# EAGLE design control (EAGLE 6.6.0)
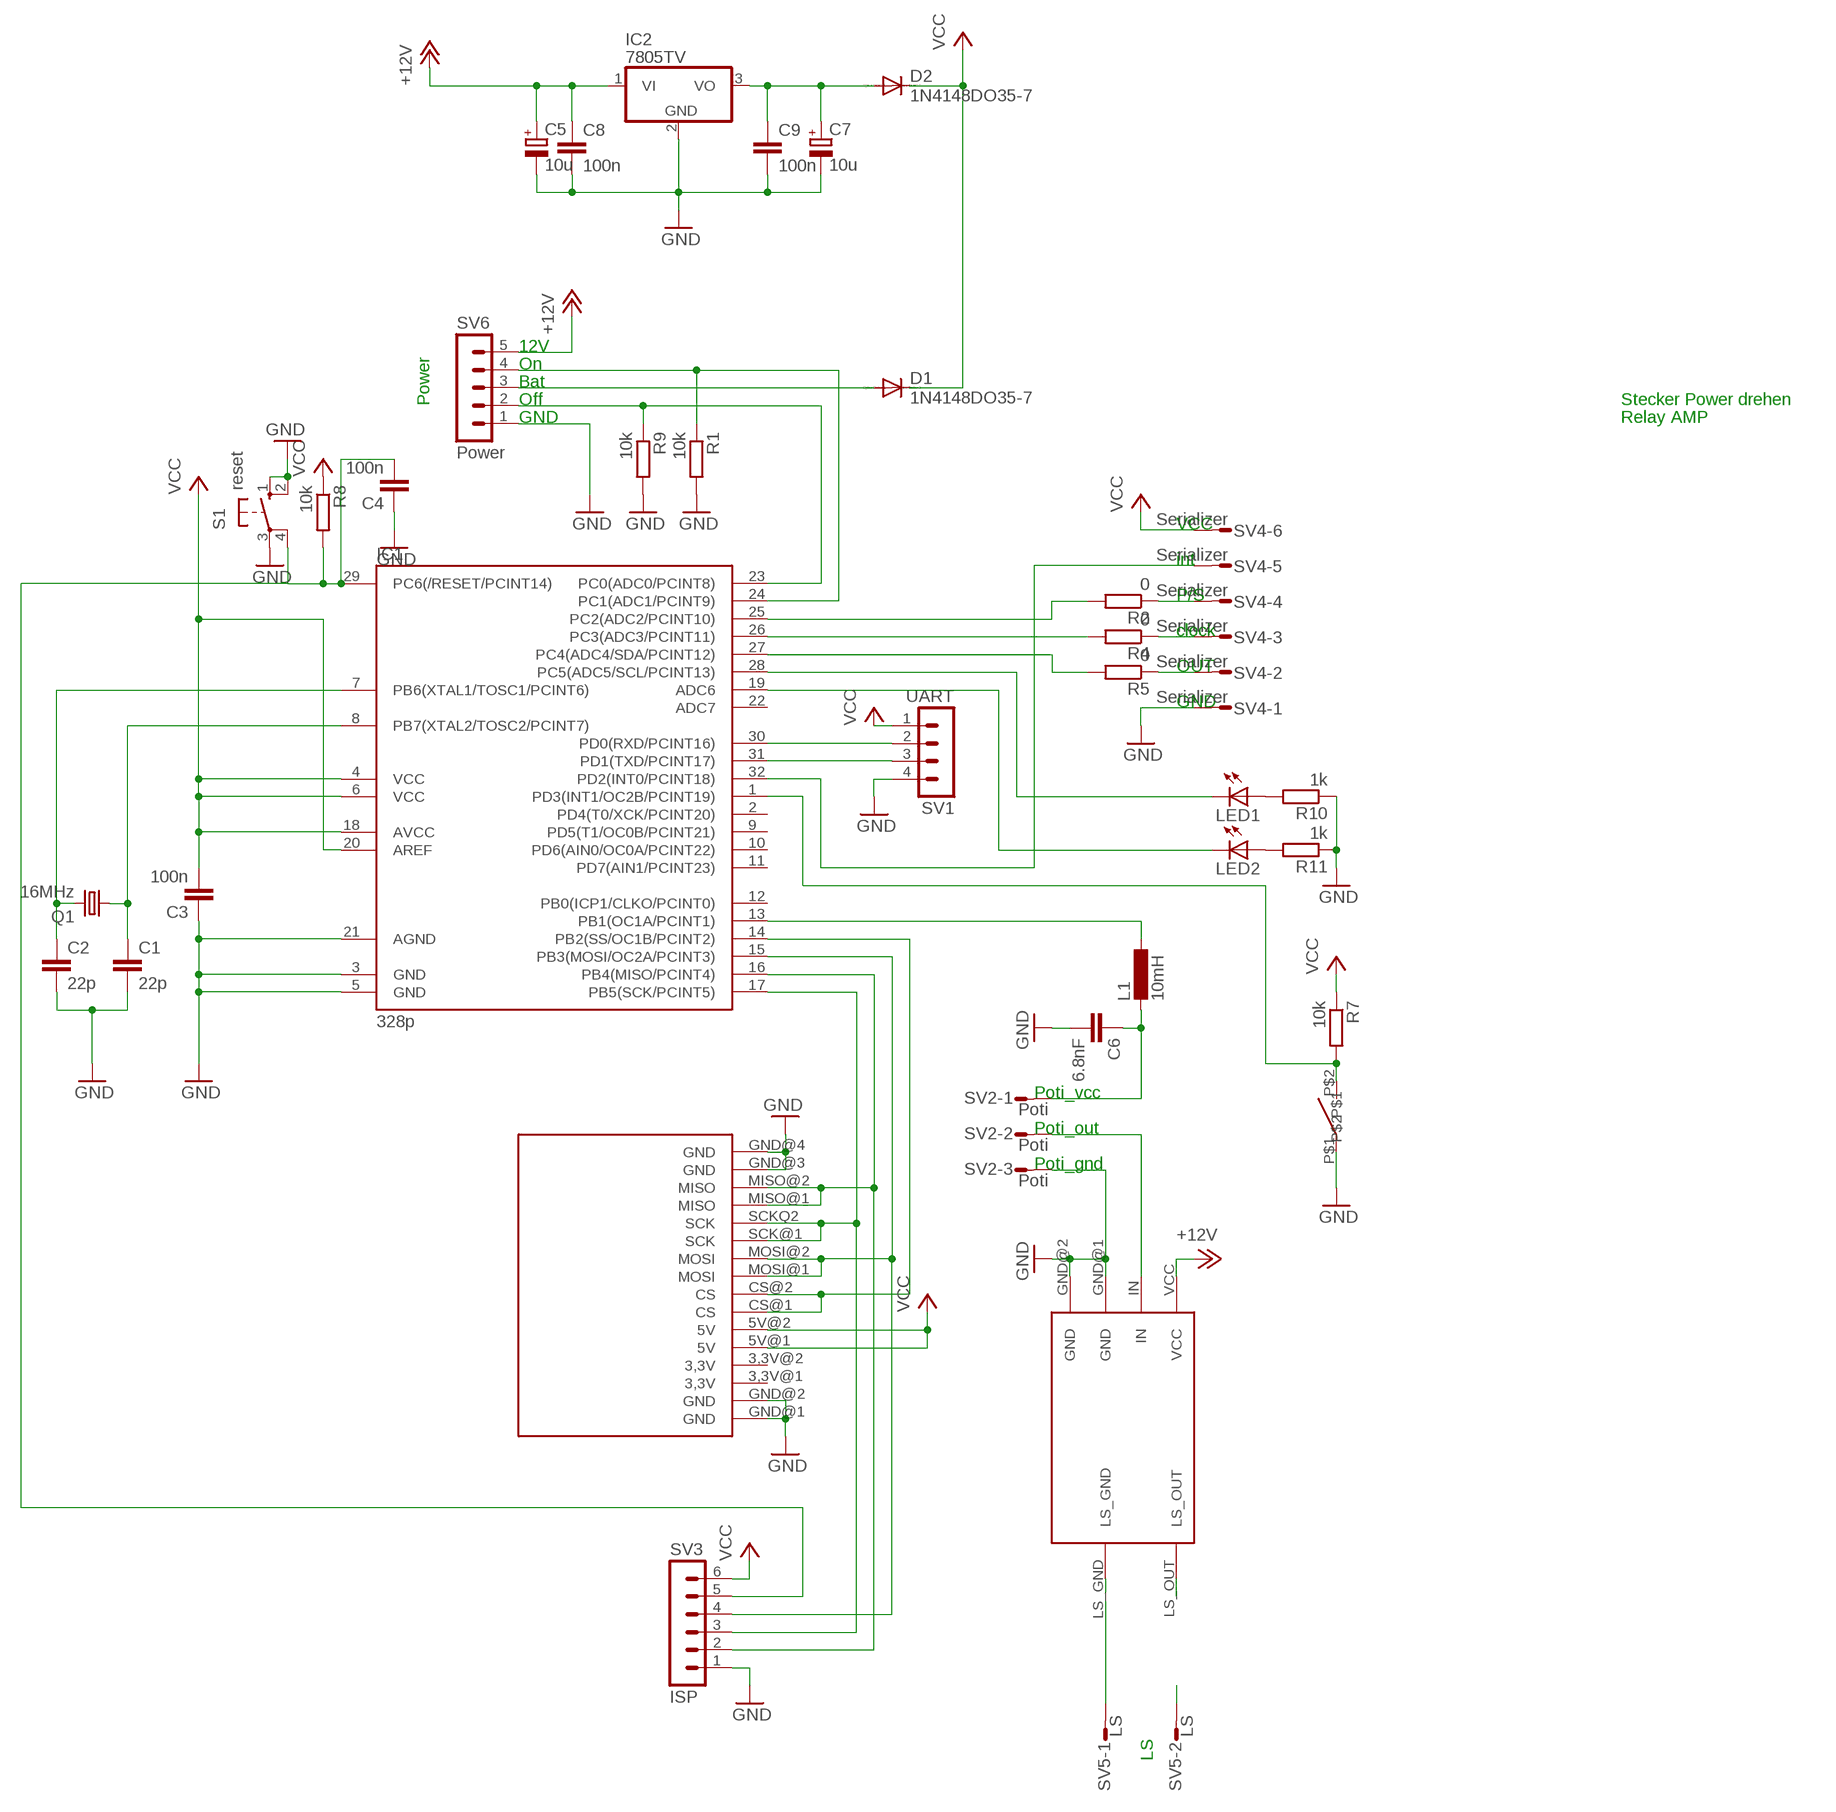
[diagram p0: schematic, sheet 1]

## Parts
C1  22p  C-EUC1206  [C1206]
C2  22p  C-EUC1206  [C1206]
C3  100n  C-EUC1206  [C1206]
C4  100n  C-EUC1206  [C1206]
C5  10u  CPOL-EUE2.5-7  [E2,5-7]
C6  6.8nF  C-EU050-024X044  [C050-024X044]
C7  10u  CPOL-EUE2.5-7  [E2,5-7]
C8  100n  C-EUC1206  [C1206]
C9  100n  C-EUC1206  [C1206]
D1  1N4148DO35-7  [DO35-7]
D2  1N4148DO35-7  [DO35-7]
IC1  328p  MEGA48/88/168-AU  [TQFP32-08]
IC2  7805TV  [TO220V]
L1  10mH  L-EU0207/5V  [0207/5V]
LED1  LEDCHIPLED_1206  [CHIPLED_1206]
LED2  LEDCHIPLED_1206  [CHIPLED_1206]
Q1  16MHz  CRYSTALHC49UP  [HC49UP]
R1  10k  R-EU_M1206  [M1206]
R2  0  R-EU_M1206  [M1206]
R4  0  R-EU_M1206  [M1206]
R5  0  R-EU_M1206  [M1206]
R7  10k  R-EU_M1206  [M1206]
R8  10k  R-EU_M1206  [M1206]
R9  10k  R-EU_M1206  [M1206]
R10  1k  R-EU_M1206  [M1206]
R11  1k  R-EU_M1206  [M1206]
S1  reset  10-XX  [B3F-10XX]
SV1  UART  MA04-1  [MA04-1]
SV2  Poti  S03P  [S03P]
SV3  ISP  MA06-1  [MA06-1]
SV4  Serializer  S06P  [S06P]
SV5  LS  S02P  [S02P]
SV6  Power  MA05-1  [MA05-1]
U$1  TILT  [TILT]
U$2  AMP  [AMP]
U$3  SD_CARD_HOLDER  [SD_CARD_HOLDER]

## Nets
+12V: C5.+ C8.1 IC2.1(VI) SV6.5 U$2.VCC
GND: C1.2 C2.2 C3.1 C4.1 C5.- C6.2 C7.- C8.2 C9.2 IC1.3(GND) IC1.5(GND) IC1.21(AGND) IC2.2(GND) R1.2 R9.2 R10.1 R11.1 S1.1(S) S1.2(S1) S1.3(P) SV1.4 SV2.3 SV3.1 SV4.1 SV6.1 U$1.P$1 U$2.GND@1(GND) U$2.GND@2(GND) U$3.GND@1(GND) U$3.GND@2(GND) U$3.GND@3(GND) U$3.GND@4(GND)
N$1: U$2.LS_OUT
N$2: IC1.30(PD0(RXD/PCINT16)) SV1.2
N$3: IC1.31(PD1(TXD/PCINT17)) SV1.3
N$4: C2.1 IC1.7(PB6(XTAL1/TOSC1/PCINT6)) Q1.2
N$5: C1.1 IC1.8(PB7(XTAL2/TOSC2/PCINT7)) Q1.1
N$6: IC1.14(PB2(SS/OC1B/PCINT2)) U$3.CS@1(CS) U$3.CS@2(CS)
N$8: IC1.15(PB3(MOSI/OC2A/PCINT3)) SV3.4 U$3.MOSI@1(MOSI) U$3.MOSI@2(MOSI)
N$9: IC1.16(PB4(MISO/PCINT4)) SV3.2 U$3.MISO@1(MISO) U$3.MISO@2(MISO)
N$12: IC1.17(PB5(SCK/PCINT5)) SV3.3 U$3.SCK@1(SCK) U$3.SCKQ2(SCK)
N$13: SV5.2
N$14: IC1.13(PB1(OC1A/PCINT1)) L1.1
N$15: C6.1 L1.2 SV2.1
N$16: SV5.1 U$2.LS_GND
N$17: SV2.2 U$2.IN
N$18: IC1.24(PC1(ADC1/PCINT9)) R1.1 SV6.4
N$19: R5.1 SV4.2
N$21: R4.1 SV4.3
N$22: R2.1 SV4.4
N$23: IC1.32(PD2(INT0/PCINT18)) SV4.5
N$24: IC1.25(PC2(ADC2/PCINT10)) R2.2
N$25: IC1.26(PC3(ADC3/PCINT11)) R4.2
N$26: IC1.23(PC0(ADC0/PCINT8)) R9.1 SV6.2
N$28: IC1.27(PC4(ADC4/SDA/PCINT12)) R5.2
N$29: IC1.1(PD3(INT1/OC2B/PCINT19)) R7.2 U$1.P$2
N$30: LED2.A R11.2
N$31: LED1.A R10.2
N$33: C7.+ C9.1 D2.A IC2.3(VO)
N$34: D1.A SV6.3
N$35: IC1.28(PC5(ADC5/SCL/PCINT13)) LED1.C
N$36: IC1.19(ADC6) LED2.C
N$37: C4.2 IC1.29(PC6(/RESET/PCINT14)) R8.2 S1.4(P1) SV3.5
VCC: C3.2 D1.C D2.C IC1.4(VCC) IC1.6(VCC) IC1.18(AVCC) IC1.20(AREF) R7.1 R8.1 SV1.1 SV3.6 SV4.6 U$3.5V@1(5V) U$3.5V@2(5V)
Unconnected: IC1.2(PD4(T0/XCK/PCINT20)) IC1.9(PD5(T1/OC0B/PCINT21)) IC1.10(PD6(AIN0/OC0A/PCINT22)) IC1.11(PD7(AIN1/PCINT23)) IC1.12(PB0(ICP1/CLKO/PCINT0)) IC1.22(ADC7) U$3.3,3V@1(3,3V) U$3.3,3V@2(3,3V)

## Notes on the sheet
- 12V
- On
- Bat
- Power | Off | Stecker Power drehen
- GND | Relay AMP
- VCC
- int
- P/S
- clock
- OUT
- GND
- Poti_vcc
- Poti_out
- Poti_gnd
- LS

## Library data of the parts
C1-C4 C6 C8 C9 = resistor:C-EU: CAPACITOR, European symbol
C5 C7 = resistor:CPOL-EU: POLARIZED CAPACITOR, European symbol
D1 D2 = diode:1N4148: DIODE high speed (Philips)
IC1 = avr-6:MEGA48/88/168
IC2 = linear:78*: Positive VOLTAGE REGULATOR Source: http://cache.national.com/ds/LM/LM78L05.pdf http://www.fairchildsemi.com/ds/LM/LM7805.pdf
L1 = resistor:L-EU: INDUCTOR, European symbol
LED1 LED2 = led:LED: LED OSRAM: - CHIPLED LG R971, LG N971, LY N971, LG Q971, LY Q971, LO R971, LY R971 LH N974, LH R974 LS Q976, LO Q976, LY Q976 LO Q996 - Hyper CHIPLED LW Q18S LB Q993, LB Q99A, LB R99A - SideLED LS A670, LO A670, LY A670, LG A670, LP A670 LB A673, LV A673, LT A673, LW A673 LH A674 LY A675 LS A676, LA A676, LO A676, LY A676, LW A676 LS A679, LY A679, LG A679 - Hyper Micro SIDELED® LS Y876, LA Y876, LO Y876, LY Y876 LT Y87S - SmartLED LW L88C, LW L88S LB L89C, LB L89S, LG L890 LS L89K, LO L89K, LY L89K LS L896, LA L896, LO L896, LY L896 - TOPLED LS T670, LO T670, LY T670, LG T670, LP T670 LSG T670, LSP T670, LSY T670, LOP T670, LYG T670 LG T671, LOG T671, LSG T671 LB T673, LV T673, LT T673, LW T673 LH T674 LS T676, LA T676, LO T676, LY T676, LB T676, LH T676, LSB T676, LW T676 LB T67C, LV T67C, LT T67C, LS T67K, LO T67K, LY T67K, LW E67C LS E67B, LA E67B, LO E67B, LY E67B, LB E67C, LV E67C, LT E67C LW T67C LS T679, LY T679, LG T679 LS T770, LO T770, LY T770, LG T770, LP T770 LB T773, LV T773, LT T773, LW T773 LH T774 LS E675, LA E675, LY E675, LS T675 LS T776, LA T776, LO T776, LY T776, LB T776 LHGB T686 LT T68C, LB T68C - Hyper Mini TOPLED® LB M676 - Mini TOPLED Santana® LG M470 LS M47K, LO M47K, LY M47K Source: http://www.osram.convergy.de LUXEON: - LUMILED® LXK2-PW12-R00, LXK2-PW12-S00, LXK2-PW14-U00, LXK2-PW14-V00 LXK2-PM12-R00, LXK2-PM12-S00, LXK2-PM14-U00 LXK2-PE12-Q00, LXK2-PE12-R00, LXK2-PE12-S00, LXK2-PE14-T00, LXK2-PE14-U00 LXK2-PB12-K00, LXK2-PB12-L00, LXK2-PB12-M00, LXK2-PB14-N00, LXK2-PB14-P00, LXK2-PB14-Q00 LXK2-PR12-L00, LXK2-PR12-M00, LXK2-PR14-Q00, LXK2-PR14-R00 LXK2-PD12-Q00, LXK2-PD12-R00, LXK2-PD12-S00 LXK2-PH12-R00, LXK2-PH12-S00 LXK2-PL12-P00, LXK2-PL12-Q00, LXK2-PL12-R00 Source: www.luxeon.com KINGBRIGHT: KA-3528ASYC Source: www.kingbright.com
Q1 = crystal:CRYSTAL: CRYSTAL; OC_FARNELL: unknown; OC_NEWARK: unknown
R1 R2 R4 R5 R7-R11 = resistor:R-EU_: RESISTOR, European symbol
S1 = switch-omron:10-XX: OMRON SWITCH; MPN: B3F-1000; OC_FARNELL: 176432; OC_NEWARK: 36M3542
SV1 = con-lstb:MA04-1: PIN HEADER; OC_FARNELL: unknown; OC_NEWARK: unknown
SV2 = con-amp-mt:S03P: AMP MT CONNECTOR; OC_FARNELL: unknown; OC_NEWARK: unknown
SV3 = con-lstb:MA06-1: PIN HEADER; OC_FARNELL: unknown; OC_NEWARK: unknown
SV4 = con-amp-mt:S06P: AMP MT CONNECTOR; OC_FARNELL: unknown; OC_NEWARK: unknown
SV5 = con-amp-mt:S02P: AMP MT CONNECTOR; OC_FARNELL: unknown; OC_NEWARK: unknown
SV6 = con-lstb:MA05-1: PIN HEADER; OC_FARNELL: unknown; OC_NEWARK: unknown
U$1 = Mein_zeug:TILT
U$2 = Mein_zeug:AMP
U$3 = Mein_zeug:SD_CARD_HOLDER

## Board
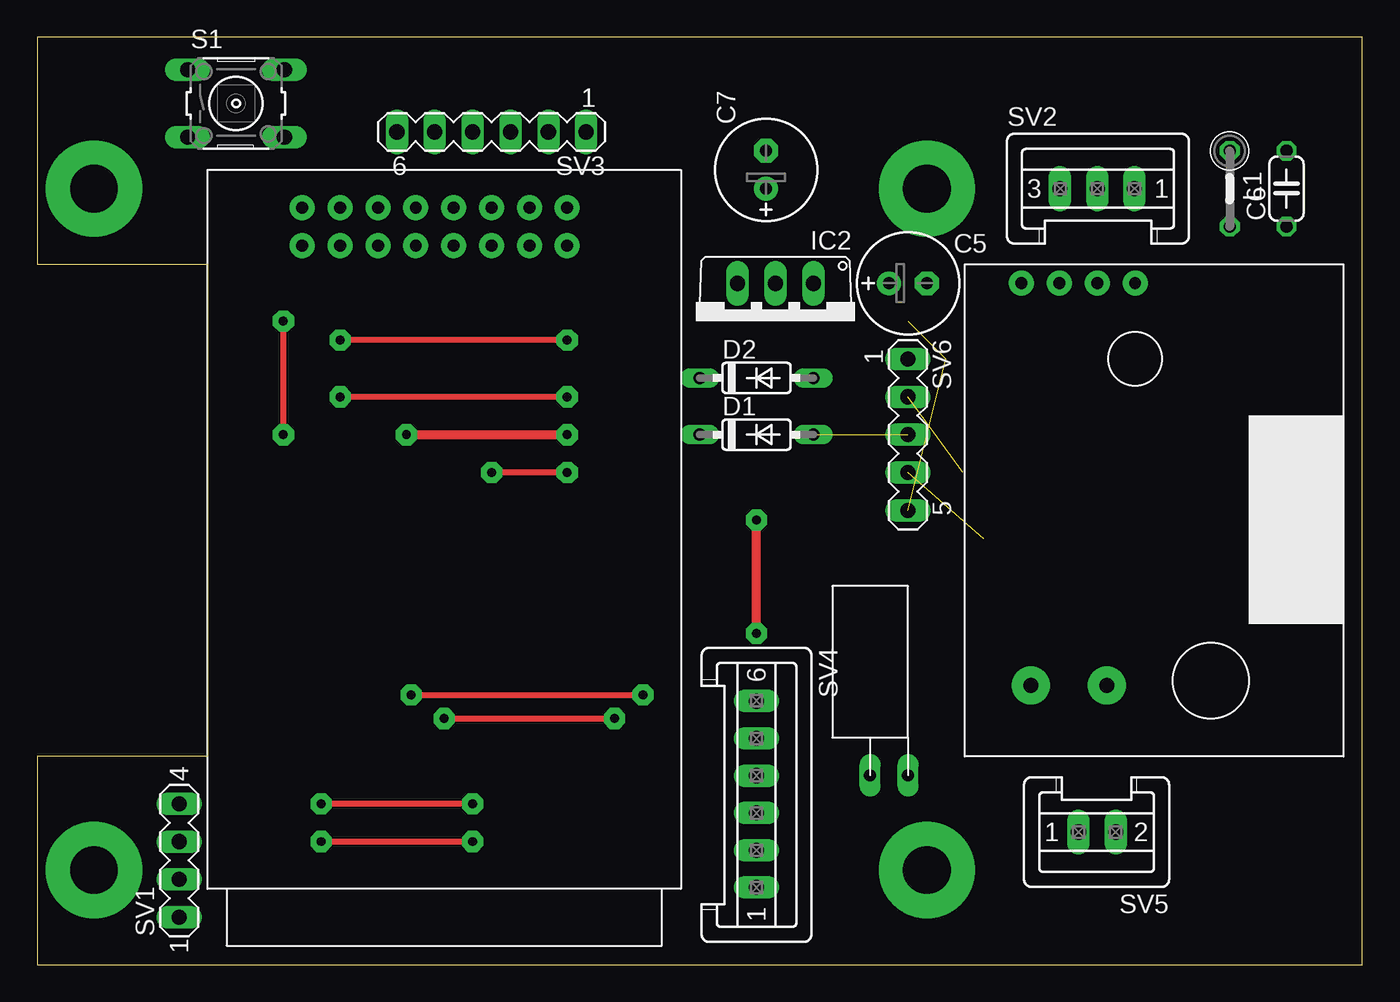
[diagram p1: board, top side]
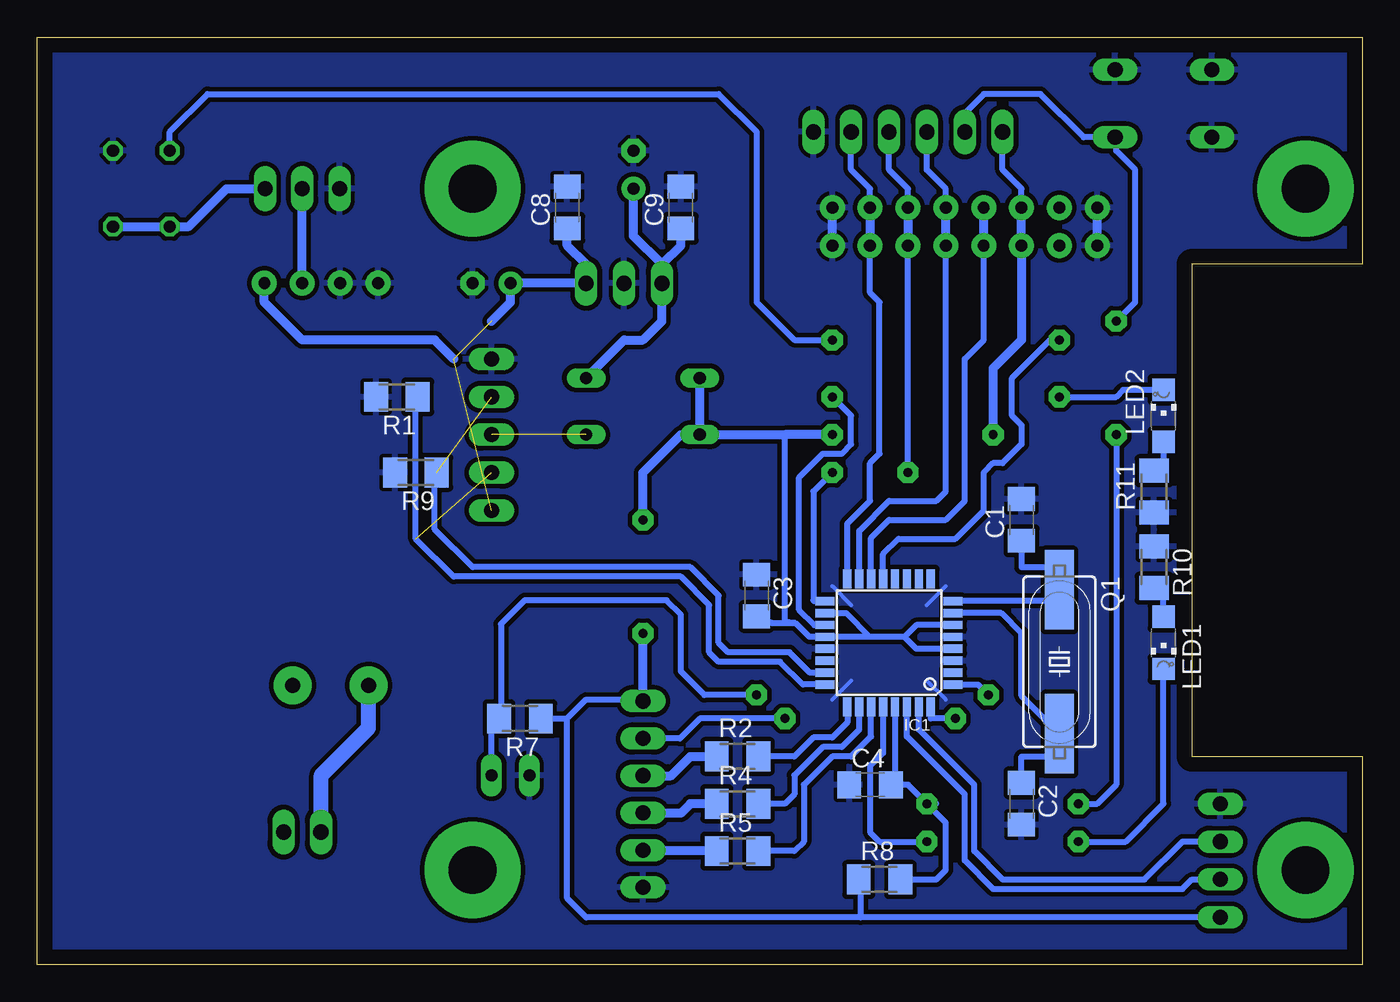
[diagram p2: board, bottom side, seen from below]

Size 88.9 x 62.23 mm. Coordinates in mm from the lower left corner, seen from the top.
Outline: 0,0 88.9,0 88.9,62.23 0,62.23 0,46.99 11.43,46.99 11.43,13.97 0,13.97 0,0
Copper layers (1*16): Top 0.035mm / dielectric 1.5mm / Bottom 0.035mm
Design rules "default": minimum track width 10mil, minimum drill 24mil, track to track 8mil, track to pad 8mil, pad to pad 8mil, via to via 8mil, smd to smd 8mil, copper to edge 40mil, drill to drill 8mil, minimum pad ring 10mil, minimum via ring 8mil, stop-mask expansion 4mil, vias tented up to drill 0mil, thermal gap 10mil
tKeepout: area 1.9,12.7 to 10.8,47

### Footprints (pad centres in the part's own frame; a part is rotated, then mirrored left to right if it is on the bottom)
C1206 = smd 1.6 x 1.8: 1 -1.4,0; 2 1.4,0
E2,5-7 = drill 0.813 pad 1.6: + -1.27,0 | drill 0.813 pad 1.6 octagon: - 1.27,0
C050-024X044 = drill 0.813 octagon: 1 -2.54,0; 2 2.54,0
DO35-7 = drill 0.813 long: A 3.81,0; C -3.81,0
TQFP32-08 = smd 1.27 x 0.559: 1 -4.293,2.8; 2 -4.293,2; 3 -4.293,1.2; 4 -4.293,0.4; 5 -4.293,-0.4; 6 -4.293,-1.2; 7 -4.293,-2; 8 -4.293,-2.8; 17 4.293,-2.8; 18 4.293,-2; 19 4.293,-1.2; 20 4.293,-0.4; 21 4.293,0.4; 22 4.293,1.2; 23 4.293,2; 24 4.293,2.8 | smd 0.559 x 1.27: 9 -2.8,-4.293; 10 -2,-4.293; 11 -1.2,-4.293; 12 -0.4,-4.293; 13 0.4,-4.293; 14 1.2,-4.293; 15 2,-4.293; 16 2.8,-4.293; 25 2.8,4.293; 26 2,4.293; 27 1.2,4.293; 28 0.4,4.293; 29 -0.4,4.293; 30 -1.2,4.293; 31 -2,4.293; 32 -2.8,4.293
TO220V = drill 1.016 long: 1 -2.54,-2.54; 2 0,-2.54; 3 2.54,-2.54
0207/5V = drill 0.813 octagon: 1 -2.54,0; 2 2.54,0
CHIPLED_1206 = smd 1.5 x 1.5: A 0,-1.75; C 0,1.75
HC49UP = smd 5.334 x 1.93: 1 -4.826,0; 2 4.826,0
M1206 = smd 1.6 x 2: 1 -1.4,0; 2 1.4,0
B3F-10XX = drill 1.016 long: 1 -3.251,2.261; 2 3.251,2.261; 3 -3.251,-2.261; 4 3.251,-2.261
MA04-1 = drill 1.016 long: 1 -3.81,0; 2 -1.27,0; 3 1.27,0; 4 3.81,0
S03P = drill 1.016 long: 1 2.5,0; 2 0,0; 3 -2.5,0
MA06-1 = drill 1.016 long: 1 -6.35,0; 2 -3.81,0; 3 -1.27,0; 4 1.27,0; 5 3.81,0; 6 6.35,0
S06P = drill 1.016 long: 1 6.25,0; 2 3.75,0; 3 1.25,0; 4 -1.25,0; 5 -3.75,0; 6 -6.25,0
S02P = drill 1.016 long: 1 1.25,0; 2 -1.25,0
MA05-1 = drill 1.016 long: 1 -5.08,0; 2 -2.54,0; 3 0,0; 4 2.54,0; 5 5.08,0
TILT = drill 0.8 pad 1.422 long: P$1 -7.62,0; P$2 -7.62,-2.54
AMP = drill 0.8 pad 1.676: GND@1 -15.24,-1.27; GND@2 -15.24,-3.81; IN -15.24,1.27; VCC -15.24,3.81 | drill 1 pad 2.54: LS_GND 11.748,-3.175; LS_OUT 11.748,1.905
SD_CARD_HOLDER = drill 0.8 pad 1.676: 3,3V@1 20.32,7.62; 3,3V@2 22.86,7.62; 5V@1 20.32,5.08; 5V@2 22.86,5.08; CS@1 20.32,2.54; CS@2 22.86,2.54; GND@1 20.32,10.16; GND@2 22.86,10.16; GND@3 20.32,-7.62; GND@4 22.86,-7.62; MISO@1 20.32,-5.08; MISO@2 22.86,-5.08; MOSI@1 20.32,0; MOSI@2 22.86,0; SCK@1 20.32,-2.54; SCKQ2 22.86,-2.54

### Placement (x,y rotation side)
C1  22.86,29.84 90 bottom
C2  22.86,10.79 270 bottom
C3  40.64,24.77 270 bottom
C4  33.02,12.06 0 bottom
C5  58.42,45.72 0 top
C6  83.82,52.07 90 top
C7  48.9,53.34 90 top
C8  53.34,50.8 90 bottom
C9  45.72,50.8 90 bottom
D1  48.26,35.56 0 top
D2  48.26,39.37 0 top
IC1  31.75,21.59 180 bottom
IC2  49.53,43.18 180 top
L1  80.01,52.07 270 top
LED1  13.34,21.59 180 bottom
LED2  13.34,36.83 0 bottom
Q1  20.32,20.32 270 bottom
R1  64.77,38.1 180 bottom
R2  41.91,13.97 0 bottom
R4  41.91,10.79 0 bottom
R5  41.91,7.62 0 bottom
R7  56.52,16.51 180 bottom
R8  32.38,5.71 0 bottom
R9  63.5,33.02 180 bottom
R10  13.97,26.67 270 bottom
R11  13.97,31.75 90 bottom
S1  13.34,57.78 0 top
SV1  9.53,6.99 90 top
SV2  71.12,52.07 0 top
SV3  30.48,55.88 180 top
SV4  48.26,11.43 270 top
SV5  71.12,8.89 180 top
SV6  58.42,35.56 270 top
U$1  55.88,20.32 90 top
U$2  69.85,30.48 270 top
U$3  27.94,27.94 90 top

### Tracks (layer width: path | path; a pad name or v marks a point on that pad's centre or on a via)
+12V  (2 unrouted)
  Bottom 0.61: 60.96,40.64 62.23,41.91 71.12,41.91 73.66,44.45 U$2.VCC | 58.42,43.18 57.15,44.45 C5.+ IC2.1 52.07,46.99 53.34,48.26 C8.1
GND
  Bottom 0.254: 27.94,25.4 29.21,24.13 | 35.56,25.4 34.29,24.13 | 35.56,17.78 34.29,19.05 | 27.94,17.78 29.21,19.05
  Bottom 0.61: U$3.GND@1 U$3.GND@2 | U$3.GND@3 U$3.GND@4
  pour Bottom (isolate 0.305): 0,0 88.9,0 88.9,62.23 0,62.23
N$2
  Bottom 0.406: SV1.2 11.43,5.71 12.06,5.08 24.77,5.08 26.67,6.99 26.67,11.43 30.55,15.31 IC1.30
N$3
  Bottom 0.406: SV1.3 12.06,8.26 14.61,5.71 24.13,5.71 26.04,7.62 26.04,12.06 29.75,15.78 IC1.31
N$4
  Bottom 0.406: IC1.7 24.23,23.59 22.86,22.23 22.86,18.03 Q1.2 20.95,14.61 20.32,13.97 22.86,13.97 C2.1 23.5,11.94
N$5
  Bottom 0.406: IC1.8 21.08,24.39 Q1.1 20.95,26.04 20.32,26.67 22.86,26.67 C1.1 23.5,28.7
N$6
  Bottom 0.406: IC1.14 32.95,28.64 31.75,29.84 27.94,29.84 26.67,31.11 26.67,40.64 25.4,41.91 U$3.CS@1
  Bottom 0.61: U$3.CS@1 U$3.CS@2
N$7  (via drill 3.2 pad 6.45)
  other vias: 3.81,6.35
N$8
  Bottom 0.406: IC1.15 33.75,29.11 31.75,31.11 28.57,31.11 27.94,31.75 U$3.MOSI@1 | U$3.MOSI@2 27.94,52.07 29.21,53.34 SV3.4
  Bottom 0.61: U$3.MOSI@1 U$3.MOSI@2
N$9
  Bottom 0.406: IC1.16 34.55,29.59 33.02,31.11 33.02,33.66 32.38,34.29 32.38,44.45 33.02,45.09 U$3.MISO@1 | U$3.MISO@2 33.02,52.07 34.29,53.34 SV3.2
  Bottom 0.61: U$3.MISO@2 U$3.MISO@1
N$10  (via drill 3.2 pad 6.45)
  other vias: 59.69,6.35
N$11  (via drill 3.2 pad 6.45)
  other vias: 3.81,52.07
N$12  (via drill 0.6 pad 1.42)
  Top 0.406: v35.56,33.02 v30.48,33.02
  Bottom 0.406: v30.48,33.02 U$3.SCK@1 | U$3.SCKQ2 30.48,52.07 31.75,53.34 SV3.3 | v35.56,33.02 36.83,31.75 36.83,24.45 36.77,24.39 IC1.17
  Bottom 0.61: U$3.SCKQ2 U$3.SCK@1
N$14  (via drill 0.6 pad 1.42)
  Top 0.406: v35.56,41.91 v20.32,41.91
  Bottom 0.406: IC1.13 32.15,27.54 31.11,28.57 27.3,28.57 25.4,30.48 25.4,33.02 24.77,33.66 24.13,33.66 22.86,34.92 22.86,36.2 23.5,36.83 23.5,39.37 20.95,41.91 v20.32,41.91 | L1.1 80.01,55.88 77.47,58.42 43.18,58.42 40.64,55.88 40.64,44.45 38.1,41.91 v35.56,41.91
N$15
  Bottom 0.61: C6.1 L1.2 78.74,49.53 76.2,52.07 SV2.1
N$16
  Bottom 1.016: SV5.1 69.85,8.91 69.85,12.7 66.67,15.88 U$2.LS_GND
N$17
  Bottom 0.61: U$2.IN SV2.2
N$18  (1 unrouted)
  Bottom 0.406: R1.1 63.5,37.97 63.5,28.57 60.96,26.04 45.72,26.04 43.81,24.13 43.81,20.95 43.18,20.32 39.05,20.32 37.52,18.79 IC1.24
N$19
  Bottom 0.61: SV4.2 43.31,7.68 R5.1
N$20  (via drill 3.2 pad 6.45)
  other vias: 59.69,52.07
N$21
  Bottom 0.61: R4.1 45.09,10.79 45.72,10.16 48.24,10.16 SV4.3
N$22
  Bottom 0.61: SV4.4 46.38,12.68 45.09,13.97 R2.1
N$23  (via drill 0.6 pad 1.42)
  Top 0.406: v27.3,16.51 v38.73,16.51
  Bottom 0.406: v38.73,16.51 44.45,16.51 45.78,15.18 SV4.5 | v27.3,16.51 28.95,16.51 IC1.32
N$24
  Bottom 0.406: IC1.25 34.55,16.25 35.56,15.24 36.83,15.24 38.1,13.97 R2.2
N$25
  Bottom 0.406: IC1.26 33.75,15.78 34.92,14.61 36.2,14.61 38.1,12.7 38.1,11.43 38.73,10.79 R4.2
N$26  (1 unrouted)
  Bottom 0.406: R9.1 62.23,32.89 62.23,29.21 59.69,26.67 45.09,26.67 43.18,24.77 43.18,21.59 42.55,20.95 38.42,20.95 37.05,19.59 IC1.23
N$28
  Bottom 0.406: IC1.27 32.95,15.31 34.29,13.97 35.56,13.97 37.47,12.06 37.47,8.26 38.1,7.62 R5.2
N$29  (via drill 0.6 pad 1.42)
  Top 0.406: v25.08,18.1 v40.64,18.1
  Bottom 0.406: U$1.P$2 58.42,16 R7.2 57.78,16.64 57.78,22.86 56.2,24.45 46.67,24.45 45.72,23.5 45.72,19.68 44.13,18.1 v40.64,18.1 | IC1.1 25.77,18.79 v25.08,18.1
N$30
  Bottom 0.406: LED2.A 13.34,33.78 R11.2
N$31
  Bottom 0.406: LED1.A 13.34,24.64 R10.2
N$33
  Bottom 0.61: 46.99,46.99 45.72,48.26 C9.1 | 46.99,46.99 IC2.3 46.99,43.18 48.26,41.91 49.53,41.91 D2.A | 46.99,46.99 48.9,48.9 C7.+
N$34  (1 unrouted)
N$35  (via drill 0.6 pad 1.42)
  Top 0.406: v29.21,8.26 v19.05,8.26
  Bottom 0.406: v19.05,8.26 15.88,8.26 13.34,10.79 LED1.C | IC1.28 32.15,14.21 33.02,13.34 33.02,8.89 32.38,8.26 v29.21,8.26
N$36  (via drill 0.6 pad 1.42)
  Top 0.406: v35.56,38.1 v20.32,38.1
  Bottom 0.406: IC1.19 36.76,22.79 37.78,23.81 37.78,32.7 36.2,34.29 34.92,34.29 34.29,34.92 34.29,36.83 v35.56,38.1 | v20.32,38.1 16.51,38.1 16.03,38.58 LED2.C
N$37  (via drill 0.6 pad 1.42)
  Top 0.406: v29.21,10.79 v19.05,10.79 | v16.51,43.18 v16.51,35.56
  Bottom 0.406: v19.05,10.79 17.78,10.79 16.51,12.06 v16.51,35.56 | SV3.5 26.67,57.15 25.4,58.42 21.59,58.42 18.69,55.52 S1.4 16.51,55.45 16.51,54.61 15.24,53.34 15.24,44.45 v16.51,43.18 | v29.21,10.79 28.57,10.79 | R8.2 28.57,5.71 27.94,6.35 27.94,9.53 v29.21,10.79 | IC1.29 31.35,12.06 C4.2 30.48,12.06 v29.21,10.79
VCC  (via drill 0.6 pad 1.42)
  Top 0.61: v48.26,22.23 v48.26,29.84 | v24.77,35.56 v35.56,35.56
  Bottom 0.406: SV1.1 33.66,3.17 | 33.66,3.17 52.07,3.17 53.34,4.45 53.34,16.51 | 53.34,16.51 52.07,17.78 48.36,17.78 SV4.6 | IC1.6 29.91,22.79 30.71,21.99 | 30.71,21.99 33.02,21.99 | 33.02,21.99 IC1.20 37.1,21.99 38.03,22.93 | IC1.4 29.91,21.19 30.71,21.99 | 38.03,22.93 38.73,22.99 38.73,35.56 | C3.2 39.56,22.93 38.03,22.93 | R8.1 33.66,4.95 33.66,3.17 | R7.1 53.34,16.51 | U$3.5V@2 22.86,52.07 24.13,53.34 SV3.6 | IC1.18 34.62,23.59 33.02,21.99
  Bottom 0.61: U$3.5V@2 U$3.5V@1 22.86,41.91 24.77,40.01 v24.77,35.56 | SV4.6 v48.26,22.23 | v35.56,35.56 38.73,35.56 D1.C | v48.26,29.84 48.26,33.02 45.72,35.56 D1.C | D1.C D2.C